# Altium schematic sheet 03_USB_TO_UART.SchDoc: USB TO UART
size A4; Date: 20/11/2014; Author: HuangRui <vowstar@gmail.com>; DrawnBy: JiYaping <jyp1817@gmail.com>; Organization: WWW.NODEMCU.COM
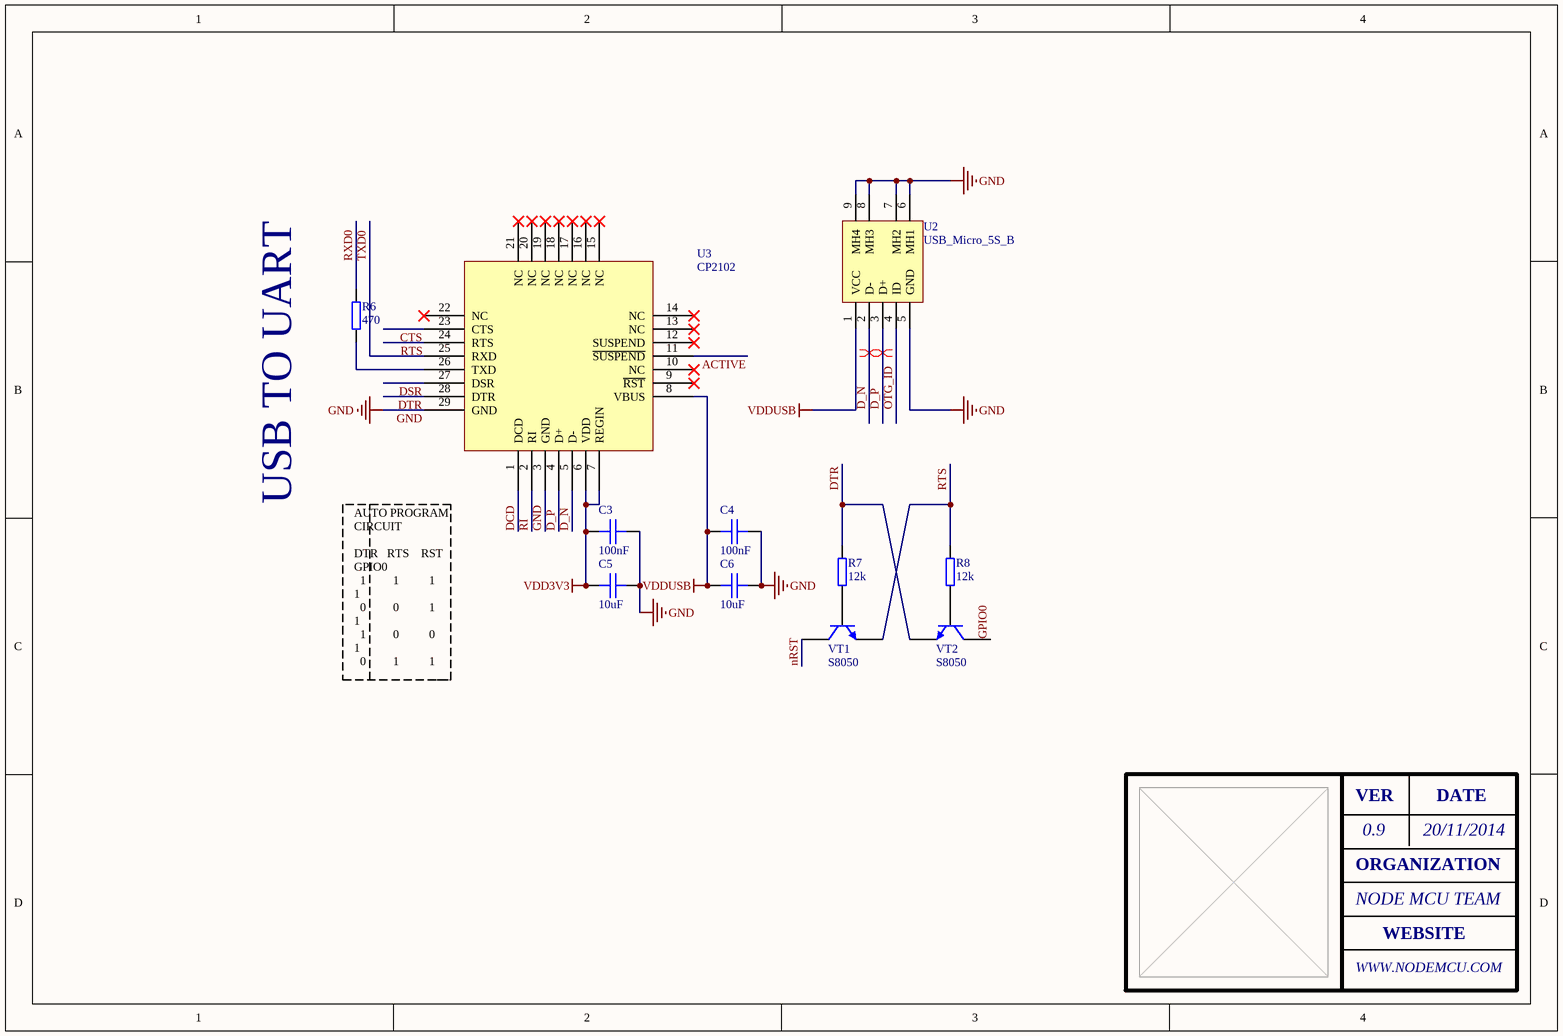
[diagram p0: 03_USB_TO_UART.SchDoc]

## Parts
C3  100nF  [SMT_C_0402]
C4  100nF  [SMT_C_0402]
C5  10uF  [SMT_C_0402]
C6  10uF  [SMT_C_0402]
R6  470  [SMT_R_0402]
R7  12k  [SMT_R_0402]
R8  12k  [SMT_R_0402]
U2  USB_Micro_5S_B  [USB_MICRO_5S_B]
U3  CP2102  [CP2102]
VT1  S8050  [SMT_TRIODE_NPN]
VT2  S8050  [SMT_TRIODE_NPN]

## Nets
GND: C3.2 C4.2 C5.2 C6.2 U2.5(GND) U2.6(MH1) U2.7(MH2) U2.8(MH3) U2.9(MH4) U3.3(GND) U3.29(GND)
VDD3V3: C3.1 C5.1 U3.6(VDD) U3.7(REGIN)
VDDUSB: C4.1 C6.1 U2.1(VCC) U3.8(VBUS)
ACTIVE: U3.11(~{SUSPEND})
CTS: U3.23(CTS)
D_N: U2.2(D-) U3.5(D-)
D_P: U2.3(D+) U3.4(D+)
DCD: U3.1(DCD)
DSR: U3.27(DSR)
DTR: R7.2 U3.28(DTR) VT2.2(E)
GPIO0: VT2.3(C)
nRST: VT1.3(C)
OTG_ID: U2.4(ID)
RI: U3.2(RI)
RTS: R8.2 U3.24(RTS) VT1.2(E)
RXD0: R6.2
TXD0: U3.25(RXD)
NetR6_1: R6.1 U3.26(TXD)
NetR7_1: R7.1 VT1.1(B)
NetR8_1: R8.1 VT2.1(B)

Not connected (* = marked no-connect by the designer): U3 9(~{RST})* 10(NC)* 12(SUSPEND)* 13(NC)* 14(NC)* 15(NC)* 16(NC)* 17(NC)* 18(NC)* 19(NC)* 20(NC)* 21(NC)* 22(NC)*

## Layout directives
differential pair: D_N, D_P

## Notes on the sheet
- AUTO PROGRAM CIRCUIT
  DTR   RTS    RST   GPIO0
  1         1          1          1
  0         0          1          1
  1         0          0          1
  0         1          1          0
- VER
- 0.9
- DATE
- ORGANIZATION
- NODE MCU TEAM
- WEBSITE

## Library data of the parts
C3-C6 = SMT_C_0402: Surface mount capacitor 0402
R6-R8 = SMT_R_0402: Surface mount resistor 0402
U2 = USB_Micro_5S_B: USB micro female SMT with 4 fixed foot
VT1 VT2 = SMT_TRIODE_NPN: Surface mount NPN transistor, package SOT-23